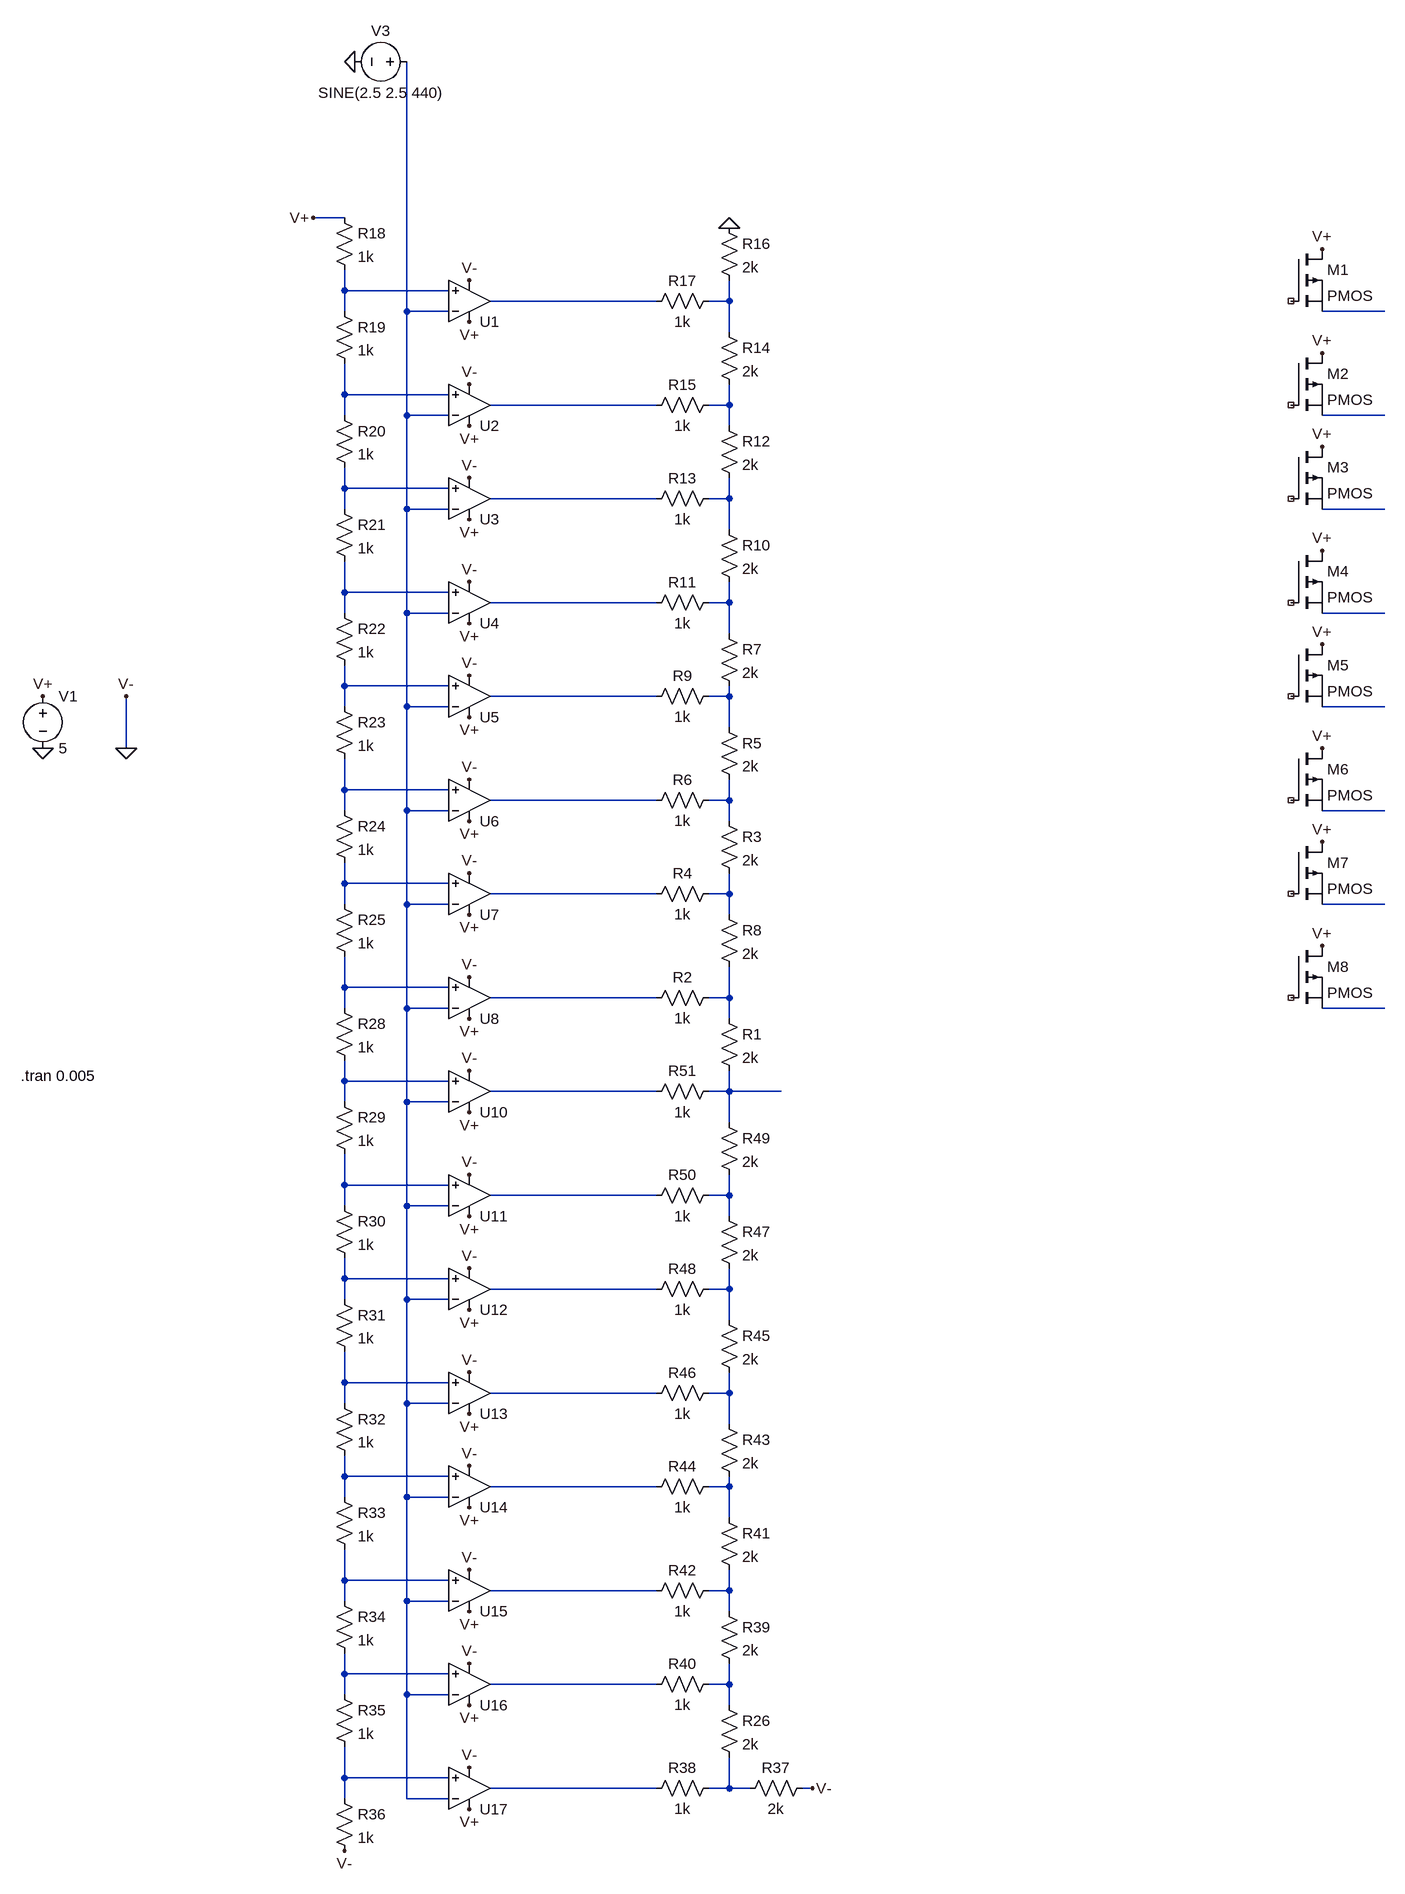
[diagram p0: schematic R2RDAC.asc]
R2RDAC.asc, the LTspice schematic file:
Version 4
SHEET 1 1524 2760
WIRE -1248 16 -1296 16
WIRE -1248 128 -1248 96
WIRE -1088 128 -1248 128
WIRE -768 144 -1024 144
WIRE -656 144 -656 112
WIRE -656 144 -688 144
WIRE -1248 160 -1248 128
WIRE -1152 160 -1152 -224
WIRE -1088 160 -1152 160
WIRE 352 160 256 160
WIRE -656 192 -656 144
WIRE -1248 288 -1248 240
WIRE -1088 288 -1248 288
WIRE -768 304 -1024 304
WIRE -656 304 -656 272
WIRE -656 304 -688 304
WIRE -1248 320 -1248 288
WIRE -1152 320 -1152 160
WIRE -1088 320 -1152 320
WIRE 352 320 256 320
WIRE -656 336 -656 304
WIRE -1248 432 -1248 400
WIRE -1088 432 -1248 432
WIRE -768 448 -1024 448
WIRE -656 448 -656 416
WIRE -656 448 -688 448
WIRE -1248 464 -1248 432
WIRE -1152 464 -1152 320
WIRE -1088 464 -1152 464
WIRE 352 464 256 464
WIRE -656 496 -656 448
WIRE -1248 592 -1248 544
WIRE -1088 592 -1248 592
WIRE -768 608 -1024 608
WIRE -656 608 -656 576
WIRE -656 608 -688 608
WIRE -1248 624 -1248 592
WIRE -1152 624 -1152 464
WIRE -1088 624 -1152 624
WIRE 352 624 256 624
WIRE -656 656 -656 608
WIRE -1248 736 -1248 704
WIRE -1088 736 -1248 736
WIRE -768 752 -1024 752
WIRE -656 752 -656 736
WIRE -656 752 -688 752
WIRE -1248 768 -1248 736
WIRE -1152 768 -1152 624
WIRE -1088 768 -1152 768
WIRE 352 768 256 768
WIRE -656 800 -656 752
WIRE -1584 832 -1584 752
WIRE -1248 896 -1248 848
WIRE -1088 896 -1248 896
WIRE -768 912 -1024 912
WIRE -656 912 -656 880
WIRE -656 912 -688 912
WIRE -1248 928 -1248 896
WIRE -1152 928 -1152 768
WIRE -1088 928 -1152 928
WIRE 352 928 256 928
WIRE -656 944 -656 912
WIRE -1248 1040 -1248 1008
WIRE -1088 1040 -1248 1040
WIRE -768 1056 -1024 1056
WIRE -656 1056 -656 1024
WIRE -656 1056 -688 1056
WIRE -1248 1072 -1248 1040
WIRE -1152 1072 -1152 928
WIRE -1088 1072 -1152 1072
WIRE 352 1072 256 1072
WIRE -656 1088 -656 1056
WIRE -1248 1200 -1248 1152
WIRE -1088 1200 -1248 1200
WIRE -768 1216 -1024 1216
WIRE -656 1216 -656 1168
WIRE -656 1216 -688 1216
WIRE -1248 1232 -1248 1200
WIRE -1152 1232 -1152 1072
WIRE -1088 1232 -1152 1232
WIRE 352 1232 256 1232
WIRE -656 1248 -656 1216
WIRE -1248 1344 -1248 1312
WIRE -1088 1344 -1248 1344
WIRE -768 1360 -1024 1360
WIRE -656 1360 -656 1328
WIRE -656 1360 -688 1360
WIRE -576 1360 -656 1360
WIRE -1248 1376 -1248 1344
WIRE -1152 1376 -1152 1232
WIRE -1088 1376 -1152 1376
WIRE -656 1408 -656 1360
WIRE -1248 1504 -1248 1456
WIRE -1088 1504 -1248 1504
WIRE -768 1520 -1024 1520
WIRE -656 1520 -656 1488
WIRE -656 1520 -688 1520
WIRE -1248 1536 -1248 1504
WIRE -1152 1536 -1152 1376
WIRE -1088 1536 -1152 1536
WIRE -656 1552 -656 1520
WIRE -1248 1648 -1248 1616
WIRE -1088 1648 -1248 1648
WIRE -768 1664 -1024 1664
WIRE -656 1664 -656 1632
WIRE -656 1664 -688 1664
WIRE -1248 1680 -1248 1648
WIRE -1152 1680 -1152 1536
WIRE -1088 1680 -1152 1680
WIRE -656 1712 -656 1664
WIRE -1248 1808 -1248 1760
WIRE -1088 1808 -1248 1808
WIRE -768 1824 -1024 1824
WIRE -656 1824 -656 1792
WIRE -656 1824 -688 1824
WIRE -1248 1840 -1248 1808
WIRE -1152 1840 -1152 1680
WIRE -1088 1840 -1152 1840
WIRE -656 1872 -656 1824
WIRE -1248 1952 -1248 1920
WIRE -1088 1952 -1248 1952
WIRE -768 1968 -1024 1968
WIRE -656 1968 -656 1952
WIRE -656 1968 -688 1968
WIRE -1248 1984 -1248 1952
WIRE -1152 1984 -1152 1840
WIRE -1088 1984 -1152 1984
WIRE -656 2016 -656 1968
WIRE -1248 2112 -1248 2064
WIRE -1088 2112 -1248 2112
WIRE -768 2128 -1024 2128
WIRE -656 2128 -656 2096
WIRE -656 2128 -688 2128
WIRE -1248 2144 -1248 2112
WIRE -1152 2144 -1152 1984
WIRE -1088 2144 -1152 2144
WIRE -656 2160 -656 2128
WIRE -1248 2256 -1248 2224
WIRE -1088 2256 -1248 2256
WIRE -768 2272 -1024 2272
WIRE -656 2272 -656 2240
WIRE -656 2272 -688 2272
WIRE -1248 2288 -1248 2256
WIRE -1152 2288 -1152 2144
WIRE -1088 2288 -1152 2288
WIRE -656 2304 -656 2272
WIRE -1248 2416 -1248 2368
WIRE -1088 2416 -1248 2416
WIRE -768 2432 -1024 2432
WIRE -656 2432 -656 2384
WIRE -656 2432 -688 2432
WIRE -624 2432 -656 2432
WIRE -528 2432 -544 2432
WIRE -1248 2448 -1248 2416
WIRE -1152 2448 -1152 2288
WIRE -1088 2448 -1152 2448
FLAG -1712 832 0
FLAG -1584 832 0
FLAG -1712 752 V+
FLAG -1296 16 V+
FLAG -1056 176 V+
FLAG -1584 752 V-
FLAG -1056 112 V-
FLAG -1056 336 V+
FLAG -1056 272 V-
FLAG -1056 480 V+
FLAG -1056 416 V-
FLAG -1056 640 V+
FLAG -1056 576 V-
FLAG -1056 784 V+
FLAG -1056 720 V-
FLAG -1056 944 V+
FLAG -1056 880 V-
FLAG -1056 1088 V+
FLAG -1056 1024 V-
FLAG -1056 1248 V+
FLAG -1056 1184 V-
FLAG -1232 -224 0
FLAG 256 64 V+
FLAG 256 224 V+
FLAG 256 368 V+
FLAG 256 528 V+
FLAG 256 672 V+
FLAG 256 832 V+
FLAG 256 976 V+
FLAG 256 1136 V+
FLAG -1056 1392 V+
FLAG -1056 1328 V-
FLAG -1056 1552 V+
FLAG -1056 1488 V-
FLAG -1056 1696 V+
FLAG -1056 1632 V-
FLAG -1056 1856 V+
FLAG -1056 1792 V-
FLAG -1056 2000 V+
FLAG -1056 1936 V-
FLAG -1056 2160 V+
FLAG -1056 2096 V-
FLAG -1056 2304 V+
FLAG -1056 2240 V-
FLAG -1056 2464 V+
FLAG -1056 2400 V-
FLAG -1248 2528 V-
FLAG -528 2432 V-
FLAG -656 32 0
SYMBOL res -672 1072 R0
SYMATTR InstName R8
SYMATTR Value 2k
SYMBOL res -784 1232 R270
WINDOW 0 32 56 VTop 2
WINDOW 3 0 56 VBottom 2
SYMATTR InstName R2
SYMATTR Value 1k
SYMBOL res -672 928 R0
SYMATTR InstName R3
SYMATTR Value 2k
SYMBOL res -784 1072 R270
WINDOW 0 32 56 VTop 2
WINDOW 3 0 56 VBottom 2
SYMATTR InstName R4
SYMATTR Value 1k
SYMBOL res -672 784 R0
SYMATTR InstName R5
SYMATTR Value 2k
SYMBOL res -784 928 R270
WINDOW 0 32 56 VTop 2
WINDOW 3 0 56 VBottom 2
SYMATTR InstName R6
SYMATTR Value 1k
SYMBOL res -672 640 R0
SYMATTR InstName R7
SYMATTR Value 2k
SYMBOL res -784 768 R270
WINDOW 0 32 56 VTop 2
WINDOW 3 0 56 VBottom 2
SYMATTR InstName R9
SYMATTR Value 1k
SYMBOL res -672 480 R0
SYMATTR InstName R10
SYMATTR Value 2k
SYMBOL res -784 624 R270
WINDOW 0 32 56 VTop 2
WINDOW 3 0 56 VBottom 2
SYMATTR InstName R11
SYMATTR Value 1k
SYMBOL res -672 320 R0
SYMATTR InstName R12
SYMATTR Value 2k
SYMBOL res -784 464 R270
WINDOW 0 32 56 VTop 2
WINDOW 3 0 56 VBottom 2
SYMATTR InstName R13
SYMATTR Value 1k
SYMBOL res -672 176 R0
SYMATTR InstName R14
SYMATTR Value 2k
SYMBOL res -784 320 R270
WINDOW 0 32 56 VTop 2
WINDOW 3 0 56 VBottom 2
SYMATTR InstName R15
SYMATTR Value 1k
SYMBOL res -672 16 R0
SYMATTR InstName R16
SYMATTR Value 2k
SYMBOL res -784 160 R270
WINDOW 0 32 56 VTop 2
WINDOW 3 0 56 VBottom 2
SYMATTR InstName R17
SYMATTR Value 1k
SYMBOL res -1264 0 R0
SYMATTR InstName R18
SYMATTR Value 1k
SYMBOL res -1264 144 R0
SYMATTR InstName R19
SYMATTR Value 1k
SYMBOL res -1264 304 R0
SYMATTR InstName R20
SYMATTR Value 1k
SYMBOL OpAmps\\UniversalOpamp2 -1056 144 M180
SYMATTR InstName U1
SYMATTR SpiceModel level.3b
SYMBOL voltage -1712 736 R0
WINDOW 123 0 0 Left 0
WINDOW 39 0 0 Left 0
SYMATTR InstName V1
SYMATTR Value 5
SYMBOL voltage -1136 -224 R90
WINDOW 0 -32 56 VBottom 2
WINDOW 3 32 56 VTop 2
WINDOW 123 0 0 Left 0
WINDOW 39 0 0 Left 0
SYMATTR InstName V3
SYMATTR Value SINE(2.5 2.5 440)
SYMBOL res -1264 448 R0
SYMATTR InstName R21
SYMATTR Value 1k
SYMBOL res -1264 608 R0
SYMATTR InstName R22
SYMATTR Value 1k
SYMBOL res -1264 752 R0
SYMATTR InstName R23
SYMATTR Value 1k
SYMBOL res -1264 912 R0
SYMATTR InstName R24
SYMATTR Value 1k
SYMBOL res -1264 1056 R0
SYMATTR InstName R25
SYMATTR Value 1k
SYMBOL OpAmps\\UniversalOpamp2 -1056 304 M180
SYMATTR InstName U2
SYMATTR SpiceModel level.3b
SYMBOL OpAmps\\UniversalOpamp2 -1056 448 M180
SYMATTR InstName U3
SYMATTR SpiceModel level.3b
SYMBOL OpAmps\\UniversalOpamp2 -1056 608 M180
SYMATTR InstName U4
SYMATTR SpiceModel level.3b
SYMBOL OpAmps\\UniversalOpamp2 -1056 752 M180
SYMATTR InstName U5
SYMATTR SpiceModel level.3b
SYMBOL OpAmps\\UniversalOpamp2 -1056 912 M180
SYMATTR InstName U6
SYMATTR SpiceModel level.3b
SYMBOL OpAmps\\UniversalOpamp2 -1056 1056 M180
SYMATTR InstName U7
SYMATTR SpiceModel level.3b
SYMBOL OpAmps\\UniversalOpamp2 -1056 1216 M180
SYMATTR InstName U8
SYMATTR SpiceModel level.3b
SYMBOL pmos 208 64 R0
SYMATTR InstName M1
SYMBOL pmos 208 224 R0
SYMATTR InstName M2
SYMBOL pmos 208 368 R0
SYMATTR InstName M3
SYMBOL pmos 208 528 R0
SYMATTR InstName M4
SYMBOL pmos 208 672 R0
SYMATTR InstName M5
SYMBOL pmos 208 832 R0
SYMATTR InstName M6
SYMBOL pmos 208 976 R0
SYMATTR InstName M7
SYMBOL pmos 208 1136 R0
SYMATTR InstName M8
SYMBOL res -1264 1216 R0
SYMATTR InstName R28
SYMATTR Value 1k
SYMBOL res -1264 1360 R0
SYMATTR InstName R29
SYMATTR Value 1k
SYMBOL res -1264 1520 R0
SYMATTR InstName R30
SYMATTR Value 1k
SYMBOL OpAmps\\UniversalOpamp2 -1056 1360 M180
SYMATTR InstName U10
SYMATTR SpiceModel level.3b
SYMBOL res -1264 1664 R0
SYMATTR InstName R31
SYMATTR Value 1k
SYMBOL res -1264 1824 R0
SYMATTR InstName R32
SYMATTR Value 1k
SYMBOL res -1264 1968 R0
SYMATTR InstName R33
SYMATTR Value 1k
SYMBOL res -1264 2128 R0
SYMATTR InstName R34
SYMATTR Value 1k
SYMBOL res -1264 2272 R0
SYMATTR InstName R35
SYMATTR Value 1k
SYMBOL res -1264 2432 R0
SYMATTR InstName R36
SYMATTR Value 1k
SYMBOL OpAmps\\UniversalOpamp2 -1056 1520 M180
SYMATTR InstName U11
SYMATTR SpiceModel level.3b
SYMBOL OpAmps\\UniversalOpamp2 -1056 1664 M180
SYMATTR InstName U12
SYMATTR SpiceModel level.3b
SYMBOL OpAmps\\UniversalOpamp2 -1056 1824 M180
SYMATTR InstName U13
SYMATTR SpiceModel level.3b
SYMBOL OpAmps\\UniversalOpamp2 -1056 1968 M180
SYMATTR InstName U14
SYMATTR SpiceModel level.3b
SYMBOL OpAmps\\UniversalOpamp2 -1056 2128 M180
SYMATTR InstName U15
SYMATTR SpiceModel level.3b
SYMBOL OpAmps\\UniversalOpamp2 -1056 2272 M180
SYMATTR InstName U16
SYMATTR SpiceModel level.3b
SYMBOL OpAmps\\UniversalOpamp2 -1056 2432 M180
SYMATTR InstName U17
SYMATTR SpiceModel level.3b
SYMBOL res -672 2288 R0
SYMATTR InstName R26
SYMATTR Value 2k
SYMBOL res -528 2416 R90
WINDOW 0 0 56 VBottom 2
WINDOW 3 32 56 VTop 2
SYMATTR InstName R37
SYMATTR Value 2k
SYMBOL res -784 2448 R270
WINDOW 0 32 56 VTop 2
WINDOW 3 0 56 VBottom 2
SYMATTR InstName R38
SYMATTR Value 1k
SYMBOL res -672 2144 R0
SYMATTR InstName R39
SYMATTR Value 2k
SYMBOL res -784 2288 R270
WINDOW 0 32 56 VTop 2
WINDOW 3 0 56 VBottom 2
SYMATTR InstName R40
SYMATTR Value 1k
SYMBOL res -672 2000 R0
SYMATTR InstName R41
SYMATTR Value 2k
SYMBOL res -784 2144 R270
WINDOW 0 32 56 VTop 2
WINDOW 3 0 56 VBottom 2
SYMATTR InstName R42
SYMATTR Value 1k
SYMBOL res -672 1856 R0
SYMATTR InstName R43
SYMATTR Value 2k
SYMBOL res -784 1984 R270
WINDOW 0 32 56 VTop 2
WINDOW 3 0 56 VBottom 2
SYMATTR InstName R44
SYMATTR Value 1k
SYMBOL res -672 1696 R0
SYMATTR InstName R45
SYMATTR Value 2k
SYMBOL res -784 1840 R270
WINDOW 0 32 56 VTop 2
WINDOW 3 0 56 VBottom 2
SYMATTR InstName R46
SYMATTR Value 1k
SYMBOL res -672 1536 R0
SYMATTR InstName R47
SYMATTR Value 2k
SYMBOL res -784 1680 R270
WINDOW 0 32 56 VTop 2
WINDOW 3 0 56 VBottom 2
SYMATTR InstName R48
SYMATTR Value 1k
SYMBOL res -672 1392 R0
SYMATTR InstName R49
SYMATTR Value 2k
SYMBOL res -784 1536 R270
WINDOW 0 32 56 VTop 2
WINDOW 3 0 56 VBottom 2
SYMATTR InstName R50
SYMATTR Value 1k
SYMBOL res -784 1376 R270
WINDOW 0 32 56 VTop 2
WINDOW 3 0 56 VBottom 2
SYMATTR InstName R51
SYMATTR Value 1k
SYMBOL res -672 1232 R0
SYMATTR InstName R1
SYMATTR Value 2k
TEXT -1746 1336 Left 2 !.tran 0.005

The netlist it stands for:
* R2RDAC.asc
R8 N028 N032 2k
R2 N031 N032 1k
R3 N024 N028 2k
R4 N027 N028 1k
R5 N020 N024 2k
R6 N023 N024 1k
R7 N016 N020 2k
R9 N019 N020 1k
R10 N012 N016 2k
R11 N015 N016 1k
R12 N008 N012 2k
R13 N011 N012 1k
R14 N003 N008 2k
R15 N007 N008 1k
R16 0 N003 2k
R17 N002 N003 1k
R18 V+ N001 1k
R19 N001 N006 1k
R20 N006 N010 1k
XU1 N001 N004 V+ 0 N002 level.3b Avol=1Meg GBW=10Meg Slew=10Meg ilimit=25m rail=0 Vos=0 phimargin=45 en=0 enk=0 in=0 ink=0 Rin=500Meg  ; pins IN+ IN- V+ V- OUT
V1 V+ 0 5
V3 N004 0 SINE(2.5 2.5 440)
R21 N010 N014 1k
R22 N014 N018 1k
R23 N018 N022 1k
R24 N022 N026 1k
R25 N026 N030 1k
XU2 N006 N004 V+ 0 N007 level.3b Avol=1Meg GBW=10Meg Slew=10Meg ilimit=25m rail=0 Vos=0 phimargin=45 en=0 enk=0 in=0 ink=0 Rin=500Meg  ; pins IN+ IN- V+ V- OUT
XU3 N010 N004 V+ 0 N011 level.3b Avol=1Meg GBW=10Meg Slew=10Meg ilimit=25m rail=0 Vos=0 phimargin=45 en=0 enk=0 in=0 ink=0 Rin=500Meg  ; pins IN+ IN- V+ V- OUT
XU4 N014 N004 V+ 0 N015 level.3b Avol=1Meg GBW=10Meg Slew=10Meg ilimit=25m rail=0 Vos=0 phimargin=45 en=0 enk=0 in=0 ink=0 Rin=500Meg  ; pins IN+ IN- V+ V- OUT
XU5 N018 N004 V+ 0 N019 level.3b Avol=1Meg GBW=10Meg Slew=10Meg ilimit=25m rail=0 Vos=0 phimargin=45 en=0 enk=0 in=0 ink=0 Rin=500Meg  ; pins IN+ IN- V+ V- OUT
XU6 N022 N004 V+ 0 N023 level.3b Avol=1Meg GBW=10Meg Slew=10Meg ilimit=25m rail=0 Vos=0 phimargin=45 en=0 enk=0 in=0 ink=0 Rin=500Meg  ; pins IN+ IN- V+ V- OUT
XU7 N026 N004 V+ 0 N027 level.3b Avol=1Meg GBW=10Meg Slew=10Meg ilimit=25m rail=0 Vos=0 phimargin=45 en=0 enk=0 in=0 ink=0 Rin=500Meg  ; pins IN+ IN- V+ V- OUT
XU8 N030 N004 V+ 0 N031 level.3b Avol=1Meg GBW=10Meg Slew=10Meg ilimit=25m rail=0 Vos=0 phimargin=45 en=0 enk=0 in=0 ink=0 Rin=500Meg  ; pins IN+ IN- V+ V- OUT
M1 V+ NC_01 N005 N005 PMOS
M2 V+ NC_02 N009 N009 PMOS
M3 V+ NC_03 N013 N013 PMOS
M4 V+ NC_04 N017 N017 PMOS
M5 V+ NC_05 N021 N021 PMOS
M6 V+ NC_06 N025 N025 PMOS
M7 V+ NC_07 N029 N029 PMOS
M8 V+ NC_08 N033 N033 PMOS
R28 N030 N034 1k
R29 N034 N037 1k
R30 N037 N040 1k
XU10 N034 N004 V+ 0 N035 level.3b Avol=1Meg GBW=10Meg Slew=10Meg ilimit=25m rail=0 Vos=0 phimargin=45 en=0 enk=0 in=0 ink=0 Rin=500Meg  ; pins IN+ IN- V+ V- OUT
R31 N040 N043 1k
R32 N043 N046 1k
R33 N046 N049 1k
R34 N049 N052 1k
R35 N052 N055 1k
R36 N055 0 1k
XU11 N037 N004 V+ 0 N038 level.3b Avol=1Meg GBW=10Meg Slew=10Meg ilimit=25m rail=0 Vos=0 phimargin=45 en=0 enk=0 in=0 ink=0 Rin=500Meg  ; pins IN+ IN- V+ V- OUT
XU12 N040 N004 V+ 0 N041 level.3b Avol=1Meg GBW=10Meg Slew=10Meg ilimit=25m rail=0 Vos=0 phimargin=45 en=0 enk=0 in=0 ink=0 Rin=500Meg  ; pins IN+ IN- V+ V- OUT
XU13 N043 N004 V+ 0 N044 level.3b Avol=1Meg GBW=10Meg Slew=10Meg ilimit=25m rail=0 Vos=0 phimargin=45 en=0 enk=0 in=0 ink=0 Rin=500Meg  ; pins IN+ IN- V+ V- OUT
XU14 N046 N004 V+ 0 N047 level.3b Avol=1Meg GBW=10Meg Slew=10Meg ilimit=25m rail=0 Vos=0 phimargin=45 en=0 enk=0 in=0 ink=0 Rin=500Meg  ; pins IN+ IN- V+ V- OUT
XU15 N049 N004 V+ 0 N050 level.3b Avol=1Meg GBW=10Meg Slew=10Meg ilimit=25m rail=0 Vos=0 phimargin=45 en=0 enk=0 in=0 ink=0 Rin=500Meg  ; pins IN+ IN- V+ V- OUT
XU16 N052 N004 V+ 0 N053 level.3b Avol=1Meg GBW=10Meg Slew=10Meg ilimit=25m rail=0 Vos=0 phimargin=45 en=0 enk=0 in=0 ink=0 Rin=500Meg  ; pins IN+ IN- V+ V- OUT
XU17 N055 N004 V+ 0 N056 level.3b Avol=1Meg GBW=10Meg Slew=10Meg ilimit=25m rail=0 Vos=0 phimargin=45 en=0 enk=0 in=0 ink=0 Rin=500Meg  ; pins IN+ IN- V+ V- OUT
R26 N054 N057 2k
R37 0 N057 2k
R38 N056 N057 1k
R39 N051 N054 2k
R40 N053 N054 1k
R41 N048 N051 2k
R42 N050 N051 1k
R43 N045 N048 2k
R44 N047 N048 1k
R45 N042 N045 2k
R46 N044 N045 1k
R47 N039 N042 2k
R48 N041 N042 1k
R49 N036 N039 2k
R50 N038 N039 1k
R51 N035 N036 1k
R1 N032 N036 2k
.model NMOS NMOS
.model PMOS PMOS
.lib standard.mos
.tran 0.005
.lib UniversalOpamps2.sub
.backanno
.end